# Altium schematic sheet 6_SWITCHING.SchDoc
size 420 x 297 mm; SheetNumber: 6; SheetTotal: 7
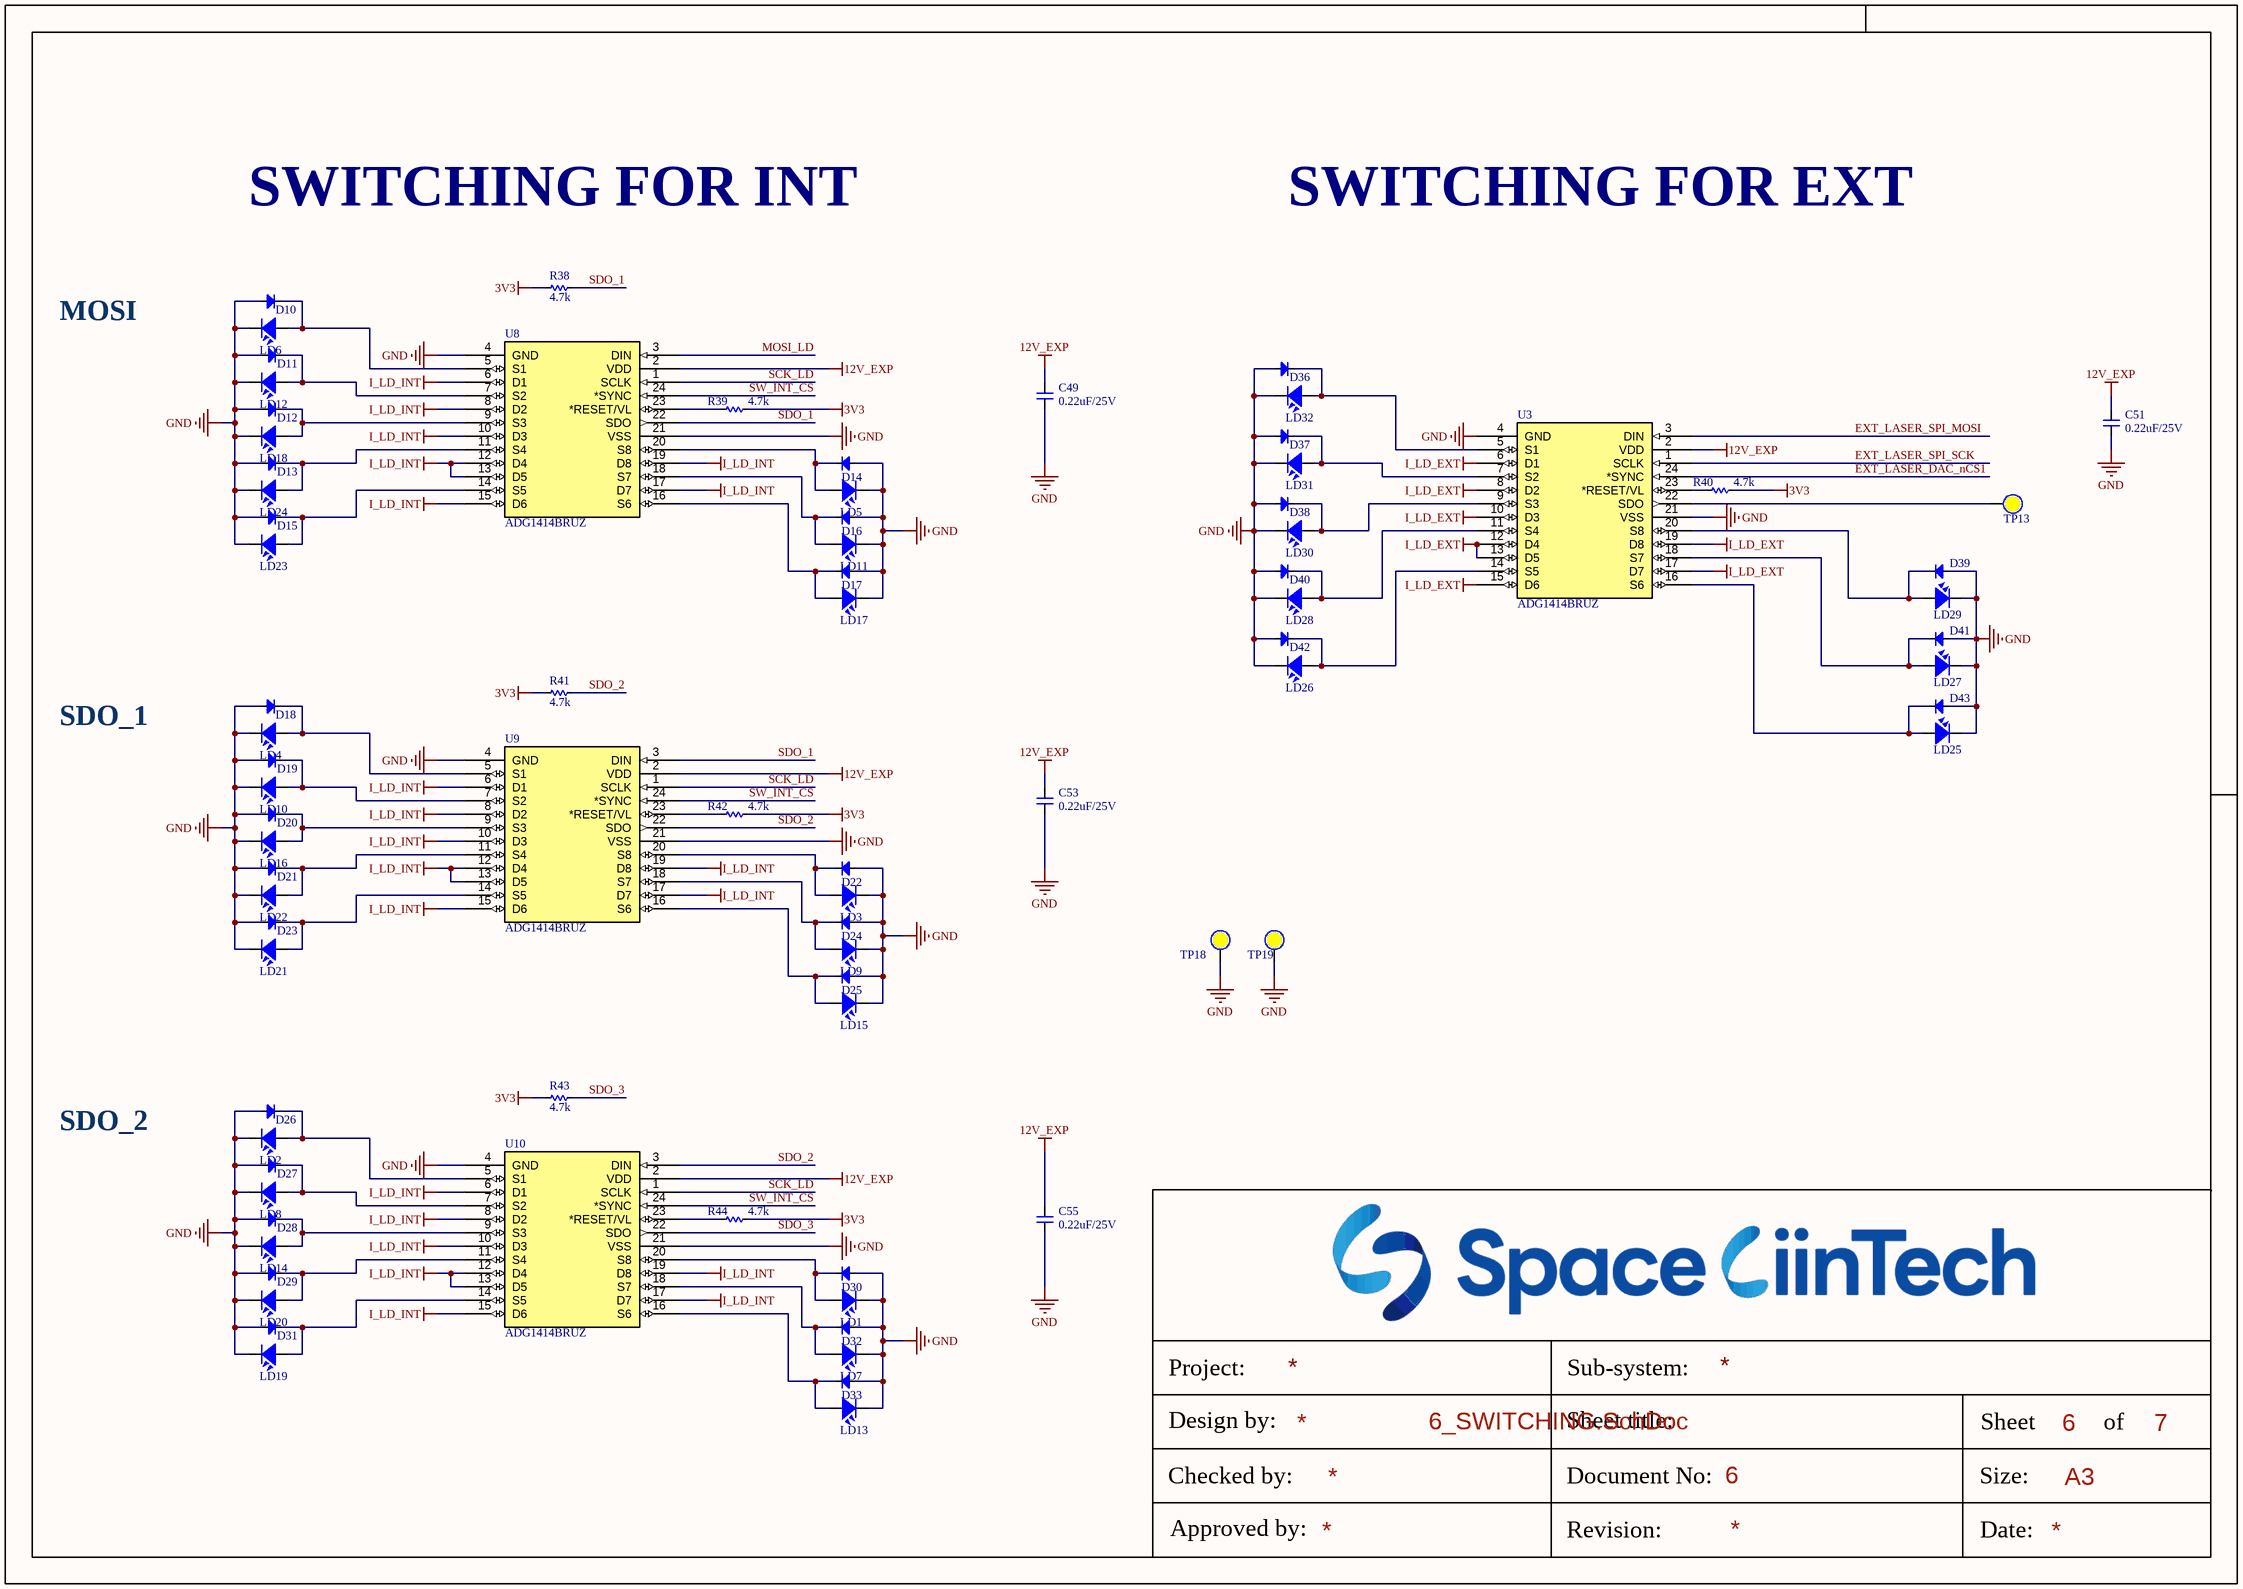
[diagram p0: 6_SWITCHING.SchDoc]

## Parts
C49  0.22uF/25V  [CAP_C_1608X80]
C51  0.22uF/25V  [CAP_C_1608X80]
C53  0.22uF/25V  [CAP_C_1608X80]
C55  0.22uF/25V  [CAP_C_1608X80]
D10  1N4148W-TP  [SOD23]  (value not drawn)
D11  1N4148W-TP  [SOD23]  (value not drawn)
D12  1N4148W-TP  [SOD23]  (value not drawn)
D13  1N4148W-TP  [SOD23]  (value not drawn)
D14  1N4148W-TP  [SOD23]  (value not drawn)
D15  1N4148W-TP  [SOD23]  (value not drawn)
D16  1N4148W-TP  [SOD23]  (value not drawn)
D17  1N4148W-TP  [SOD23]  (value not drawn)
D18  1N4148W-TP  [SOD23]  (value not drawn)
D19  1N4148W-TP  [SOD23]  (value not drawn)
D20  1N4148W-TP  [SOD23]  (value not drawn)
D21  1N4148W-TP  [SOD23]  (value not drawn)
D22  1N4148W-TP  [SOD23]  (value not drawn)
D23  1N4148W-TP  [SOD23]  (value not drawn)
D24  1N4148W-TP  [SOD23]  (value not drawn)
D25  1N4148W-TP  [SOD23]  (value not drawn)
D26  1N4148W-TP  [SOD23]  (value not drawn)
D27  1N4148W-TP  [SOD23]  (value not drawn)
D28  1N4148W-TP  [SOD23]  (value not drawn)
D29  1N4148W-TP  [SOD23]  (value not drawn)
D30  1N4148W-TP  [SOD23]  (value not drawn)
D31  1N4148W-TP  [SOD23]  (value not drawn)
D32  1N4148W-TP  [SOD23]  (value not drawn)
D33  1N4148W-TP  [SOD23]  (value not drawn)
D36  1N4148W-TP  [SOD23]  (value not drawn)
D37  1N4148W-TP  [SOD23]  (value not drawn)
D38  1N4148W-TP  [SOD23]  (value not drawn)
D39  1N4148W-TP  [SOD23]  (value not drawn)
D40  1N4148W-TP  [SOD23]  (value not drawn)
D41  1N4148W-TP  [SOD23]  (value not drawn)
D42  1N4148W-TP  [SOD23]  (value not drawn)
D43  1N4148W-TP  [SOD23]  (value not drawn)
LD1  LaserDiode  [OPV302]  (value not drawn)
LD2  LaserDiode  [OPV302]  (value not drawn)
LD3  LaserDiode  [OPV302]  (value not drawn)
LD4  LaserDiode  [OPV302]  (value not drawn)
LD5  LaserDiode  [OPV302]  (value not drawn)
LD6  LaserDiode  [OPV302]  (value not drawn)
LD7  LaserDiode  [OPV302]  (value not drawn)
LD8  LaserDiode  [OPV302]  (value not drawn)
LD9  LaserDiode  [OPV302]  (value not drawn)
LD10  LaserDiode  [OPV302]  (value not drawn)
LD11  LaserDiode  [OPV302]  (value not drawn)
LD12  LaserDiode  [OPV302]  (value not drawn)
LD13  LaserDiode  [OPV302]  (value not drawn)
LD14  LaserDiode  [OPV302]  (value not drawn)
LD15  LaserDiode  [OPV302]  (value not drawn)
LD16  LaserDiode  [OPV302]  (value not drawn)
LD17  LaserDiode  [OPV302]  (value not drawn)
LD18  LaserDiode  [OPV302]  (value not drawn)
LD19  LaserDiode  [OPV302]  (value not drawn)
LD20  LaserDiode  [OPV302]  (value not drawn)
LD21  LaserDiode  [OPV302]  (value not drawn)
LD22  LaserDiode  [OPV302]  (value not drawn)
LD23  LaserDiode  [OPV302]  (value not drawn)
LD24  LaserDiode  [OPV302]  (value not drawn)
LD25  LaserDiode  [RLD65NZX1]  (value not drawn)
LD26  LaserDiode  [RLD65NZX1]  (value not drawn)
LD27  LaserDiode  [RLD65NZX1]  (value not drawn)
LD28  LaserDiode  [RLD65NZX1]  (value not drawn)
LD29  LaserDiode  [RLD65NZX1]  (value not drawn)
LD30  LaserDiode  [RLD65NZX1]  (value not drawn)
LD31  LaserDiode  [RLD65NZX1]  (value not drawn)
LD32  LaserDiode  [RLD65NZX1]  (value not drawn)
R38  4.7k  [RES_C_1608X60]
R39  4.7k  [RES_C_1608X60]
R40  4.7k  [RES_C_1608X60]
R41  4.7k  [RES_C_1608X60]
R42  4.7k  [RES_C_1608X60]
R43  4.7k  [RES_C_1608X60]
R44  4.7k  [RES_C_1608X60]
TP13  (no value)  [Testpoint_80]  (no BOM)
TP18  (no value)  [Testpoint_80]  (no BOM)
TP19  (no value)  [Testpoint_80]  (no BOM)
U3  ADG1414BRUZ  [TSSOP24]
U8  ADG1414BRUZ  [TSSOP24]
U9  ADG1414BRUZ  [TSSOP24]
U10  ADG1414BRUZ  [TSSOP24]

## Nets
3V3: R38.1 R39.2 R40.2 R41.1 R42.2 R43.1 R44.2
12V_EXP: C49.2 C51.2 C53.2 C55.2 U3.2(VDD) U8.2(VDD) U9.2(VDD) U10.2(VDD)
GND: C49.1 C51.1 C53.1 C55.1 D10.1(A) D11.1(A) D12.1(A) D13.1(A) D14.1(A) D15.1(A) D16.1(A) D17.1(A) D18.1(A) D19.1(A) D20.1(A) D21.1(A) D22.1(A) D23.1(A) D24.1(A) D25.1(A) D26.1(A) D27.1(A) D28.1(A) D29.1(A) D30.1(A) D31.1(A) D32.1(A) D33.1(A) D36.1(A) D37.1(A) D38.1(A) D39.1(A) D40.1(A) D41.1(A) D42.1(A) D43.1(A) LD1.2 LD2.2 LD3.2 LD4.2 LD5.2 LD6.2 LD7.2 LD8.2 LD9.2 LD10.2 LD11.2 LD12.2 LD13.2 LD14.2 LD15.2 LD16.2 LD17.2 LD18.2 LD19.2 LD20.2 LD21.2 LD22.2 LD23.2 LD24.2 LD25.1 LD26.1 LD27.1 LD28.1 LD29.1 LD30.1 LD31.1 LD32.1 TP18.1 TP19.1 U3.4(GND) U3.21(VSS) U8.4(GND) U8.21(VSS) U9.4(GND) U9.21(VSS) U10.4(GND) U10.21(VSS)
I_LD_EXT: U3.6(D1) U3.8(D2) U3.10(D3) U3.12(D4) U3.13(D5) U3.15(D6) U3.17(D7) U3.19(D8)
I_LD_INT: U8.6(D1) U8.8(D2) U8.10(D3) U8.12(D4) U8.13(D5) U8.15(D6) U8.17(D7) U8.19(D8) U9.6(D1) U9.8(D2) U9.10(D3) U9.12(D4) U9.13(D5) U9.15(D6) U9.17(D7) U9.19(D8) U10.6(D1) U10.8(D2) U10.10(D3) U10.12(D4) U10.13(D5) U10.15(D6) U10.17(D7) U10.19(D8)
EXT_LASER_DAC_nCS1: U3.24(*SYNC)
EXT_LASER_SPI_MOSI: U3.3(DIN)
EXT_LASER_SPI_SCK: U3.1(SCLK)
MOSI_LD: U8.3(DIN)
SCK_LD: U8.1(SCLK) U9.1(SCLK) U10.1(SCLK)
SDO_1: R38.2 U8.22(SDO) U9.3(DIN)
SDO_2: R41.2 U9.22(SDO) U10.3(DIN)
SDO_3: R43.2 U10.22(SDO)
SW_INT_CS: U8.24(*SYNC) U9.24(*SYNC) U10.24(*SYNC)
NetD10_2: D10.2(K) LD6.1 U8.5(S1)
NetD11_2: D11.2(K) LD12.1 U8.7(S2)
NetD12_2: D12.2(K) LD18.1 U8.9(S3)
NetD13_2: D13.2(K) LD24.1 U8.11(S4)
NetD14_2: D14.2(K) LD5.1 U8.20(S8)
NetD15_2: D15.2(K) LD23.1 U8.14(S5)
NetD16_2: D16.2(K) LD11.1 U8.18(S7)
NetD17_2: D17.2(K) LD17.1 U8.16(S6)
NetD18_2: D18.2(K) LD4.1 U9.5(S1)
NetD19_2: D19.2(K) LD10.1 U9.7(S2)
NetD20_2: D20.2(K) LD16.1 U9.9(S3)
NetD21_2: D21.2(K) LD22.1 U9.11(S4)
NetD22_2: D22.2(K) LD3.1 U9.20(S8)
NetD23_2: D23.2(K) LD21.1 U9.14(S5)
NetD24_2: D24.2(K) LD9.1 U9.18(S7)
NetD25_2: D25.2(K) LD15.1 U9.16(S6)
NetD26_2: D26.2(K) LD2.1 U10.5(S1)
NetD27_2: D27.2(K) LD8.1 U10.7(S2)
NetD28_2: D28.2(K) LD14.1 U10.9(S3)
NetD29_2: D29.2(K) LD20.1 U10.11(S4)
NetD30_2: D30.2(K) LD1.1 U10.20(S8)
NetD31_2: D31.2(K) LD19.1 U10.14(S5)
NetD32_2: D32.2(K) LD7.1 U10.18(S7)
NetD33_2: D33.2(K) LD13.1 U10.16(S6)
NetD36_2: D36.2(K) LD32.3 U3.5(S1)
NetD37_2: D37.2(K) LD31.3 U3.7(S2)
NetD38_2: D38.2(K) LD30.3 U3.9(S3)
NetD39_2: D39.2(K) LD29.3 U3.20(S8)
NetD40_2: D40.2(K) LD28.3 U3.11(S4)
NetD41_2: D41.2(K) LD27.3 U3.18(S7)
NetD42_2: D42.2(K) LD26.3 U3.14(S5)
NetD43_2: D43.2(K) LD25.3 U3.16(S6)
NetR39_1: R39.1 U8.23(*RESET/VL)
NetR40_1: R40.1 U3.23(*RESET/VL)
NetR42_1: R42.1 U9.23(*RESET/VL)
NetR44_1: R44.1 U10.23(*RESET/VL)
NetTP13_1: TP13.1 U3.22(SDO)

## Notes on the sheet
- SWITCHING FOR INT
- SWITCHING FOR EXT
- MOSI
- SDO_1
- SDO_2
- Project:
- Sub-system:
- Design by:
- Sheet title:
- Sheet
- A3
- of
- Checked by:
- Approved by:
- Revision:
- Document No:
- Size:
- Date:

## Library data of the parts
C49 C51 C53 C55 = _CAP_C_2: CAP
D10-D33 D36-D43 = Diode SMD: Code - JEDEC: DO-214-AB; Value: 1N5007; Published: 8-Jun-2000; Revision: July-2002: Re-released for DXP Platform.; Publisher: Altium Limited
LD1-LD24 = LD: OPV302
LD25-LD32 = LD_RLD65NZX1: RLD65NZX1
R38-R44 = _RES_B_2: RES
TP13 TP18 TP19 = Test Point: Solder: NF